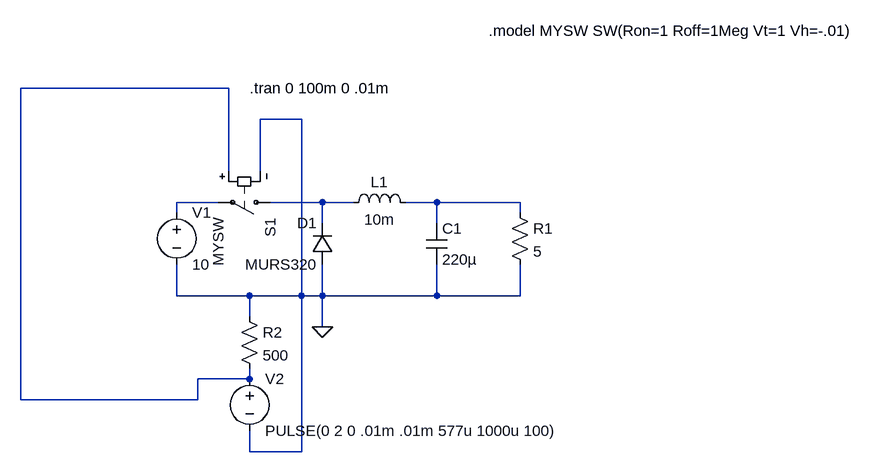
[diagram p0: schematic stepdown.asc]
stepdown.asc, the LTspice schematic file:
Version 4
SHEET 1 1128 680
WIRE 48 -48 -272 -48
WIRE 160 0 96 0
WIRE 48 80 48 -48
WIRE 96 80 96 0
WIRE 32 128 -32 128
WIRE 192 128 112 128
WIRE 240 128 192 128
WIRE 368 128 320 128
WIRE 496 128 368 128
WIRE -32 144 -32 128
WIRE 496 144 496 128
WIRE 192 160 192 128
WIRE 368 160 368 128
WIRE -32 272 -32 224
WIRE 80 272 -32 272
WIRE 160 272 160 0
WIRE 160 272 80 272
WIRE 192 272 192 224
WIRE 192 272 160 272
WIRE 368 272 368 224
WIRE 368 272 192 272
WIRE 496 272 496 224
WIRE 496 272 368 272
WIRE 80 304 80 272
WIRE 192 320 192 272
WIRE 80 400 80 384
WIRE 80 400 0 400
WIRE -272 432 -272 -48
WIRE 0 432 0 400
WIRE 0 432 -272 432
WIRE 80 512 80 480
WIRE 160 512 160 272
WIRE 160 512 80 512
FLAG 192 320 0
SYMBOL diode 208 224 R180
WINDOW 0 24 64 Left 2
WINDOW 3 24 0 Left 2
SYMATTR InstName D1
SYMATTR Value MURS320
SYMBOL ind 224 144 R270
WINDOW 0 32 56 VTop 2
WINDOW 3 5 56 VBottom 2
SYMATTR InstName L1
SYMATTR Value 10m
SYMBOL cap 352 160 R0
SYMATTR InstName C1
SYMATTR Value 220µ
SYMBOL res 480 128 R0
SYMATTR InstName R1
SYMATTR Value 5
SYMBOL voltage -32 128 R0
WINDOW 123 0 0 Left 2
WINDOW 39 0 0 Left 2
SYMATTR InstName V1
SYMATTR Value 10
SYMBOL voltage 80 384 R0
WINDOW 123 0 0 Left 2
WINDOW 39 0 0 Left 2
SYMATTR InstName V2
SYMATTR Value PULSE(0 2 0 .01m .01m 577u 1000u 100)
SYMBOL res 64 288 R0
SYMATTR InstName R2
SYMATTR Value 500
SYMBOL sw 128 128 R90
SYMATTR InstName S1
SYMATTR Value MYSW
SYMATTR SpiceLine 1
TEXT 80 -48 Left 2 !.tran 0 100m 0 .01m
TEXT 448 -136 Left 2 !.model MYSW SW(Ron=1 Roff=1Meg Vt=1 Vh=-.01)

The netlist it stands for:
* stepdown.asc
D1 0 N003 MURS320
L1 N003 N004 10m
C1 N004 0 220µ
R1 N004 0 5
V1 N002 0 10
V2 N001 0 PULSE(0 2 0 .01m .01m 577u 1000u 100)
R2 0 N001 500
S1 N003 N002 N001 0 MYSW 1
.model D D
.lib standard.dio
.tran 0 100m 0 .01m
.model MYSW SW(Ron=1 Roff=1Meg Vt=1 Vh=-.01)
.backanno
.end